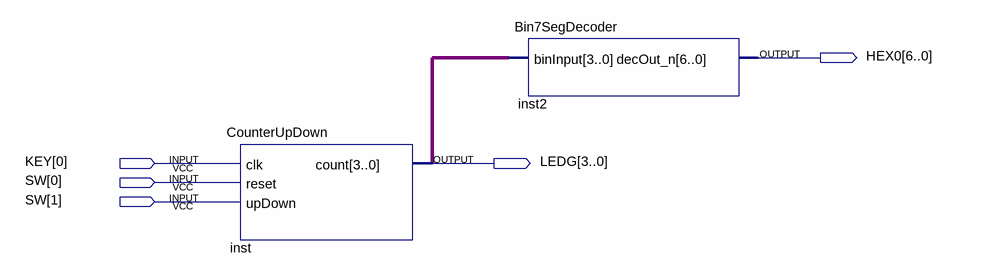
[diagram p0: schematic sheet]
// Quartus schematic Counter_Demo.bdf as structural Verilog: 2 symbols, 5 pins
module Counter_Demo (
  input  [0:0] KEY,
  input  [1:0] SW,
  output [6:0] HEX0,
  output [3:0] LEDG
);

  CounterUpDown inst (.clk(KEY[0]), .reset(SW[0]), .upDown(SW[1]), .count(LEDG));
  Bin7SegDecoder inst2 (.binInput(LEDG), .decOut_n(HEX0));
endmodule
